# Altium schematic sheet ToC.SchDoc: Table of Contents
size 279 x 215 mm; CompanyName: Flat Earth Inc.; DrawnBy: Connor Dack; Engineer: Connor Dack; Address1: 985 Technology Blvd; Address2: Suite 102; Address3: Bozeman, MT, 59718; DocumentNumber: 2; Revision: 0.0; SheetNumber: 2; SheetTotal: 11
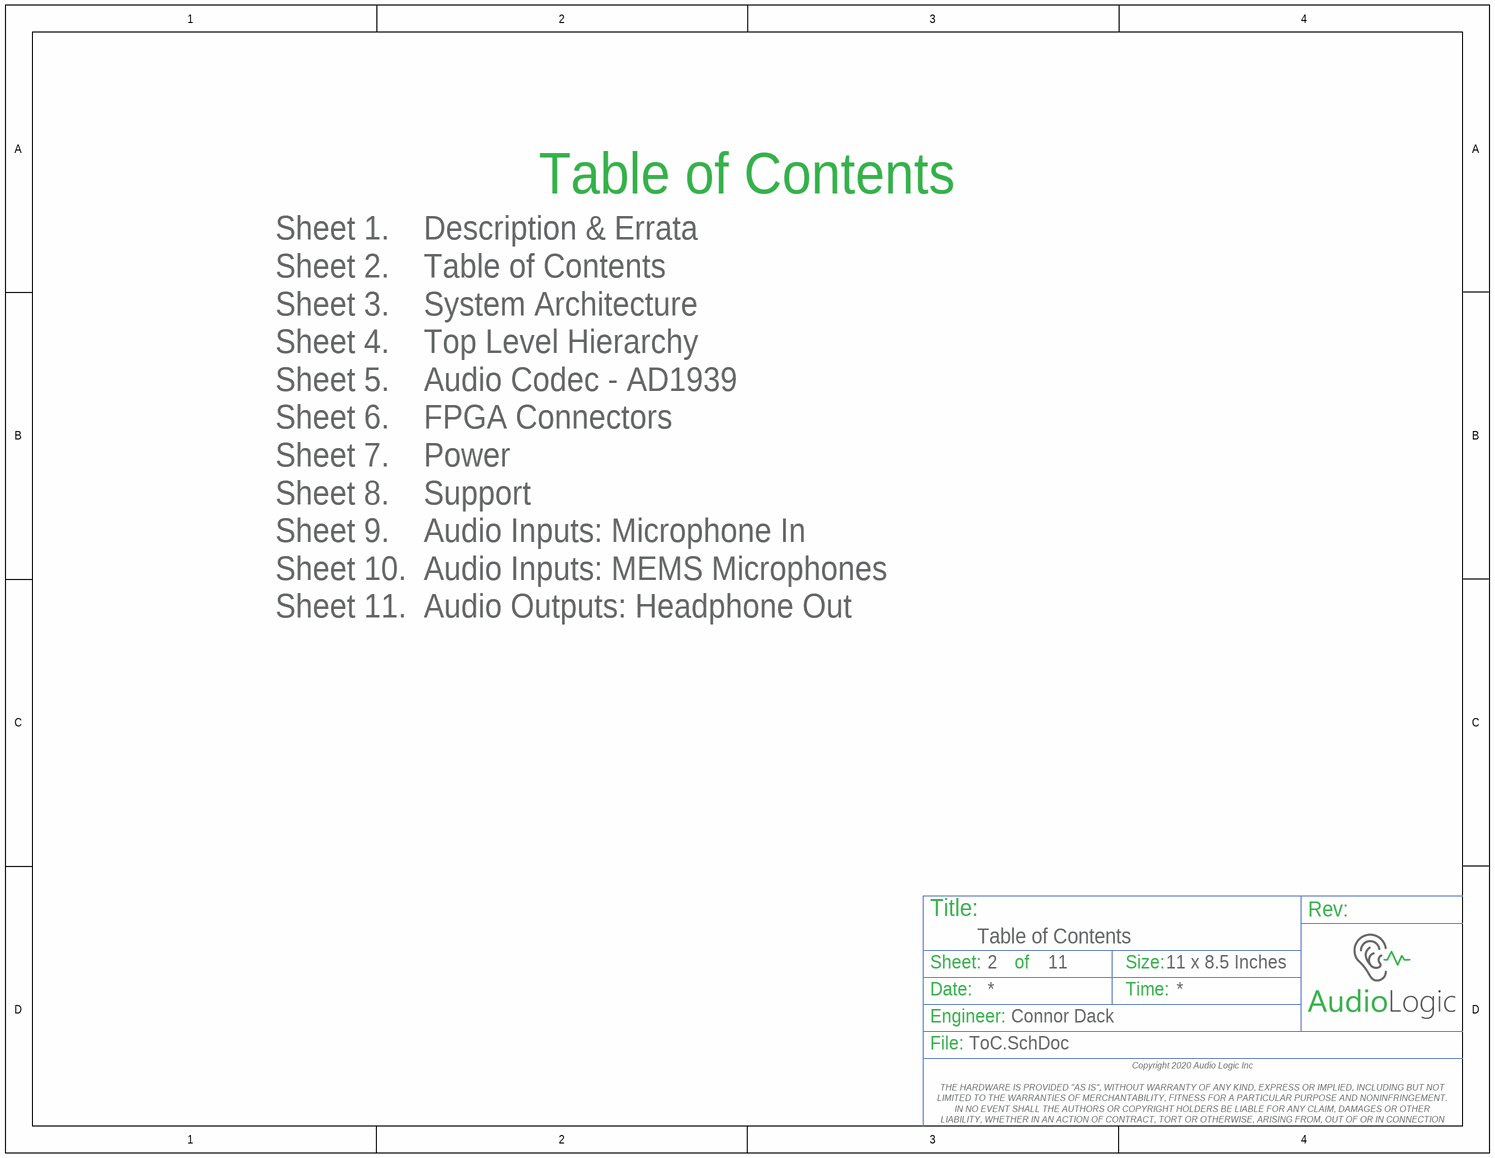
[diagram p0: ToC.SchDoc]

## Notes on the sheet
- Table of Contents
- Sheet 1.    Description & Errata
  Sheet 2.    Table of Contents
  Sheet 3.    System Architecture
  Sheet 4.    Top Level Hierarchy
  Sheet 5.    Audio Codec - AD1939
  Sheet 6.    FPGA Connectors
  Sheet 7.    Power
  Sheet 8.    Support
  Sheet 9.    Audio Inputs: Microphone In
  Sheet 10.  Audio Inputs: MEMS Microphones
  Sheet 11.  Audio Outputs: Headphone Out
- Title:
- Sheet:
- of
- Size:
- 11 x 8.5 Inches
- Rev:
- Date:
- Engineer:
- Time:
- File:
- Copyright 2020 Audio Logic Inc
  THE HARDWARE IS PROVIDED "AS IS", WITHOUT WARRANTY OF ANY KIND, EXPRESS OR IMPLIED, INCLUDING BUT NOT LIMITED TO THE WARRANTIES OF MERCHANTABILITY, FITNESS FOR A PARTICULAR PURPOSE AND NONINFRINGEMENT. IN NO EVENT SHALL THE AUTHORS OR COPYRIGHT HOLDERS BE LIABLE FOR ANY CLAIM, DAMAGES OR OTHER LIABILITY, WHETHER IN AN ACTION OF CONTRACT, TORT OR OTHERWISE, ARISING FROM, OUT OF OR IN CONNECTION WITH THE HARDWARE OR THE USE OR OTHER DEALINGS IN THE HARDWARE.